# EasyEDA Pro project szu-etep-stc89c52rc-2024.epro

# Schematic Schematic1
Create Date: 2024-04-16; Page Name: P1; Project Name: classwork2; Schematic Name: Schematic1; Update Date: 2024-04-16; Company: 嘉立创EDA; Page Size: A4; Version: V1.0
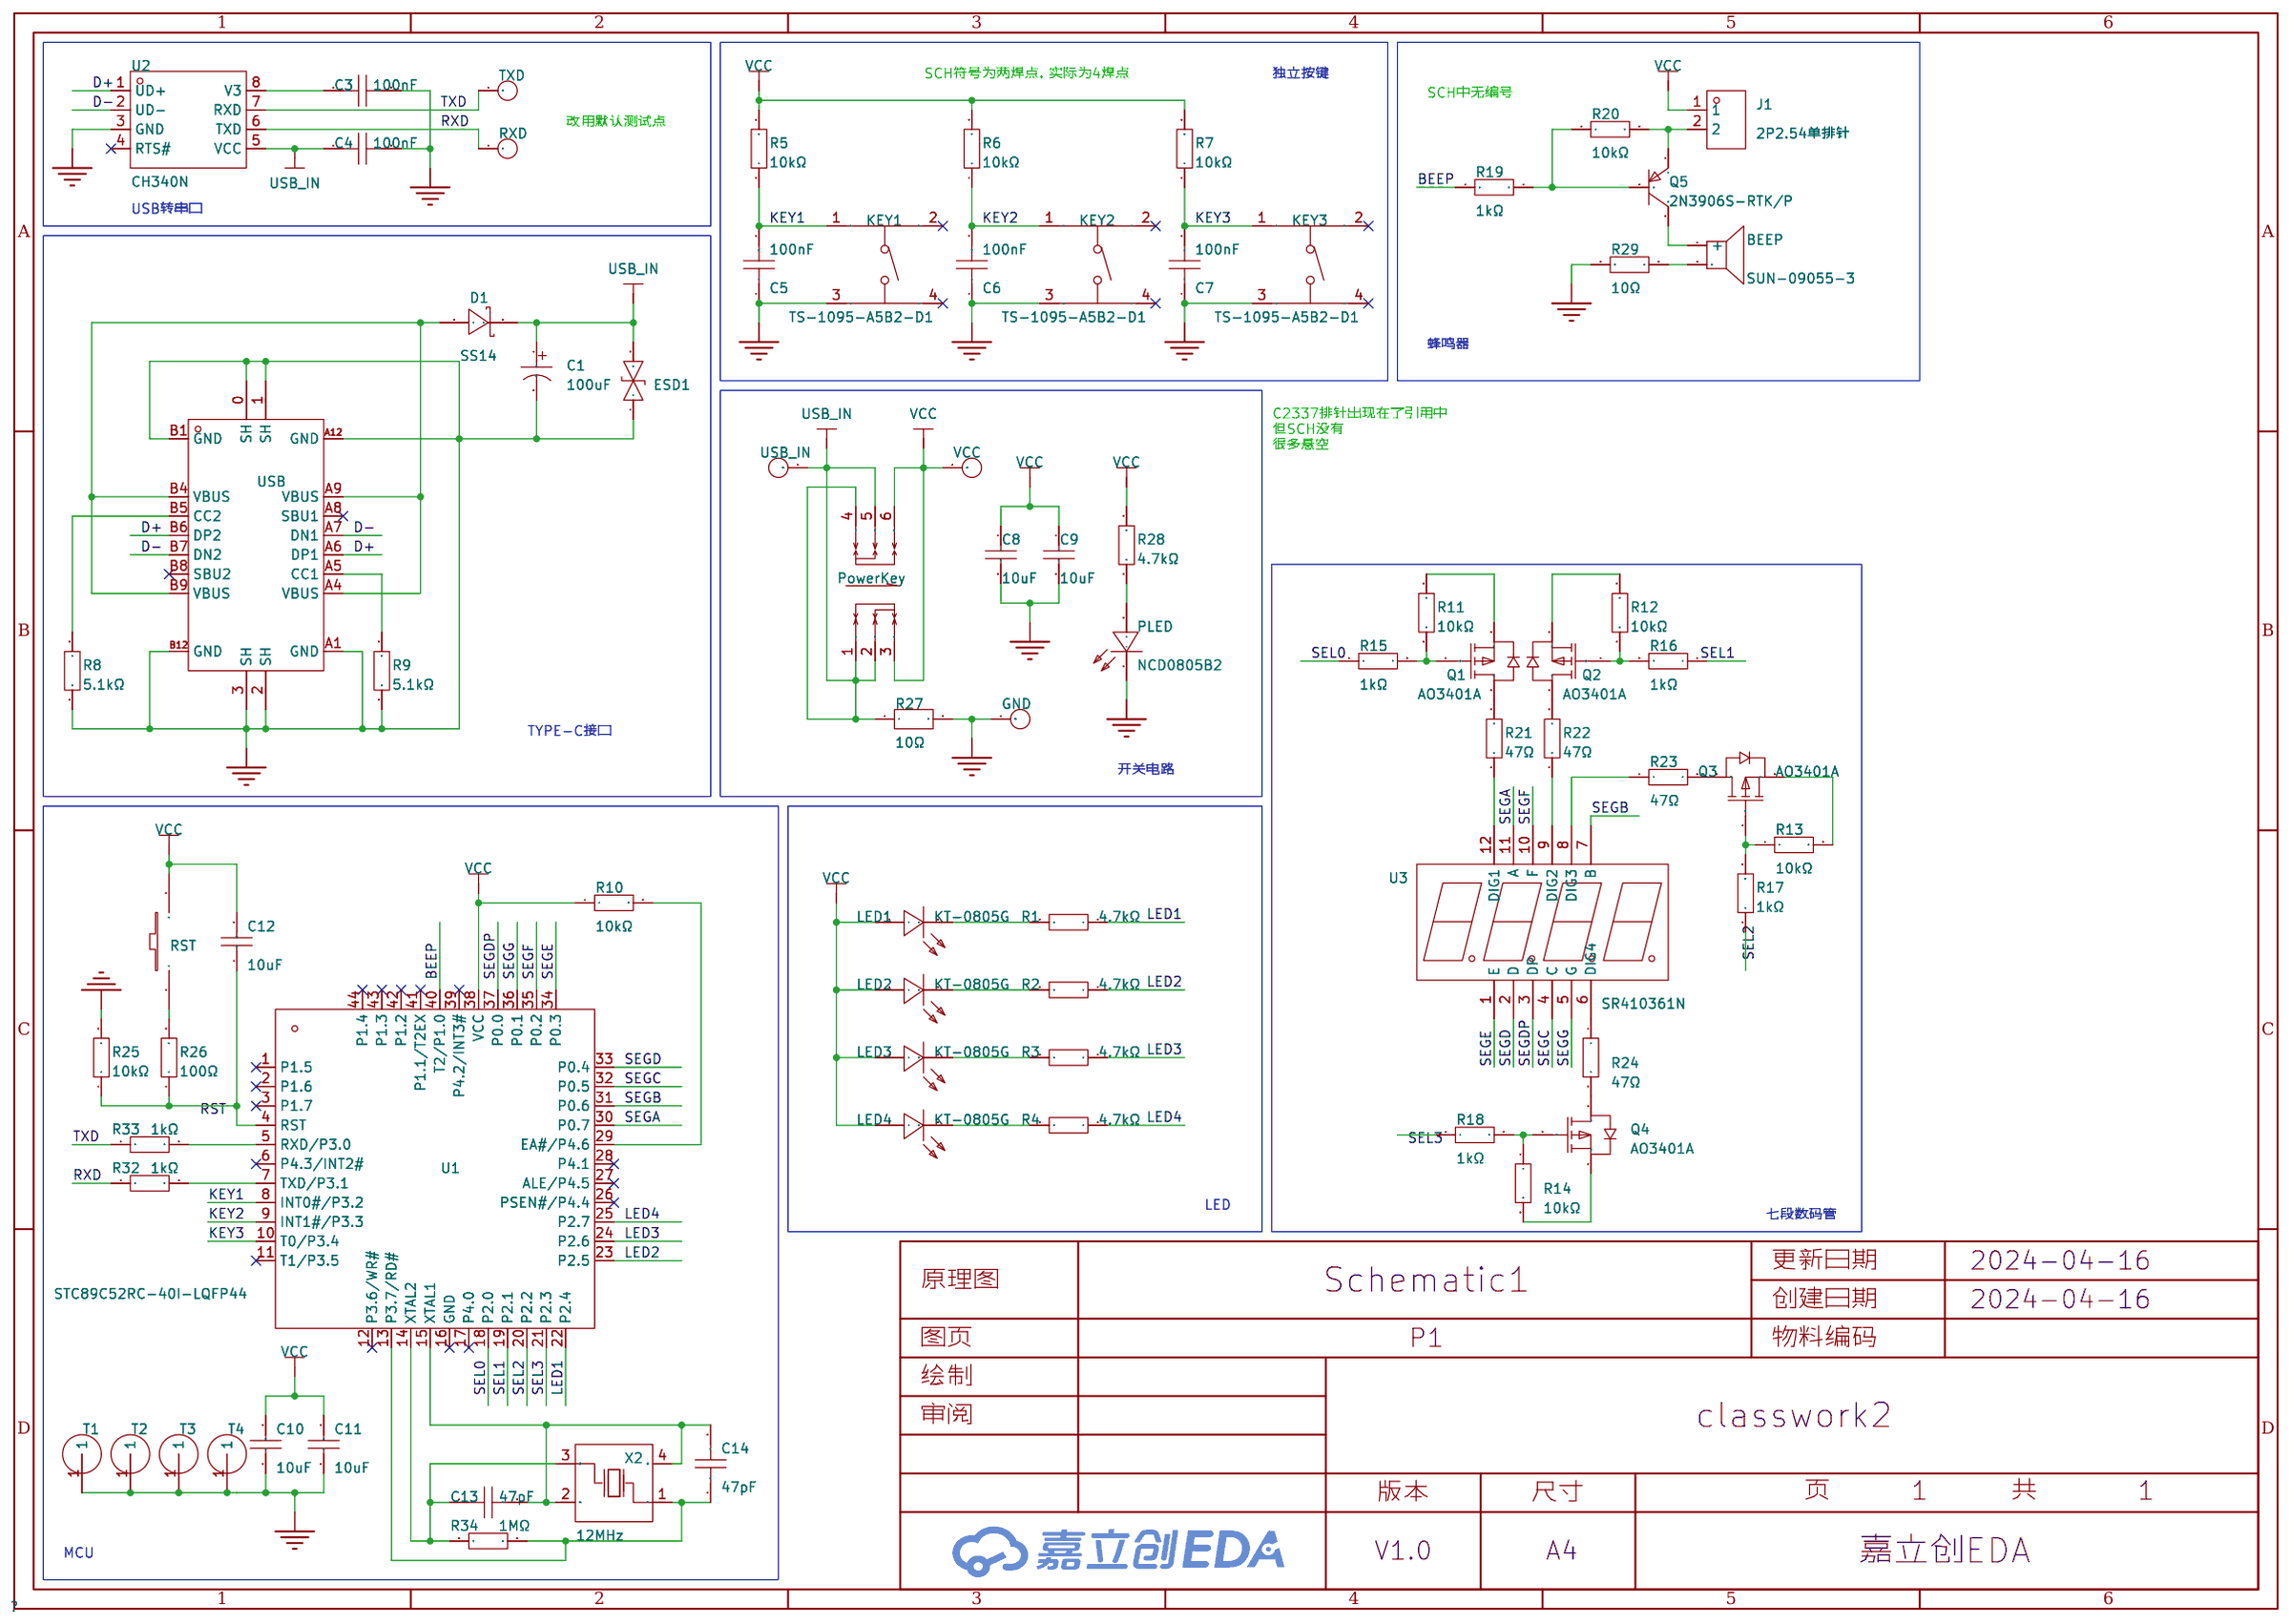
[diagram p0: schematic sheet]

## Parts
BEEP  SUN-09055-3  [BUZ-TH_BD9.0-P5.00-D0.6-FD]
C1  100uF  [CAP-TH_BD5.0-P2.00-D0.8-FD]
C3  100nF  [C0603]
C4  100nF  [C0603]
C5  100nF  [C0603]
C6  100nF  [C0603]
C7  100nF  [C0603]
C8  10uF  [C0603]
C9  10uF  [C0603]
C10  10uF  [C0603]
C11  10uF  [C0603]
C12  10uF  [C0603]
C13  47pF  [C0603]
C14  47pF  [C0603]
D1  SS14  [SMA_L4.3-W2.6-LS5.2-RD]
ESD1  0603ESDA-05N  [D0603-BI]
GND  -  [测试点0.9mm]
J1  2P2.54单排针  [HDR-TH_2P-P2.54-V-M]
KEY1  TS-1095-A5B2-D1  [SW-TH_4P-L6.0-W6.0-P4.50-LS6.5]
KEY2  TS-1095-A5B2-D1  [SW-TH_4P-L6.0-W6.0-P4.50-LS6.5]
KEY3  TS-1095-A5B2-D1  [SW-TH_4P-L6.0-W6.0-P4.50-LS6.5]
LED1  KT-0805G  [LED0805-R-RD]
LED2  KT-0805G  [LED0805-R-RD]
LED3  KT-0805G  [LED0805-R-RD]
LED4  KT-0805G  [LED0805-R-RD]
PLED  NCD0805B2  [LED0805-R-RD]
PowerKey  XKB8080-Z  [SW-TH_6P-L8.0-W8.0-P2.50]
Q1  AO3401A  [SOT-23_L2.9-W1.3-P1.90-LS2.4-BR]
Q2  AO3401A  [SOT-23_L2.9-W1.3-P1.90-LS2.4-BR]
Q3  AO3401A  [SOT-23_L2.9-W1.3-P1.90-LS2.4-BR]
Q4  AO3401A  [SOT-23_L2.9-W1.3-P1.90-LS2.4-BR]
Q5  2N3906S-RTK/P  [SOT-23-3_L2.9-W1.6-P1.90-LS2.8-TR-CW]
R1  4.7kΩ  [R0603]
R2  4.7kΩ  [R0603]
R3  4.7kΩ  [R0603]
R4  4.7kΩ  [R0603]
R5  10kΩ  [R0402]
R6  10kΩ  [R0402]
R7  10kΩ  [R0402]
R8  5.1kΩ  [R0603]
R9  5.1kΩ  [R0603]
R10  10kΩ  [R0402]
R11  10kΩ  [R0603]
R12  10kΩ  [R0603]
R13  10kΩ  [R0603]
R14  10kΩ  [R0603]
R15  1kΩ  [R0603]
R16  1kΩ  [R0603]
R17  1kΩ  [R0603]
R18  1kΩ  [R0603]
R19  1kΩ  [R0603]
R20  10kΩ  [R0603]
R21  47Ω  [R0603]
R22  47Ω  [R0603]
R23  47Ω  [R0603]
R24  47Ω  [R0603]
R25  10kΩ  [R0402]
R26  100Ω  [R0603]
R27  10Ω  [R1206]
R28  4.7kΩ  [R0603]
R29  10Ω  [R0603]
R32  1kΩ  [R0603]
R33  1kΩ  [R0603]
R34  1MΩ  [R0603]
RST  轻触开关,3*6*2.5塑头白色,260G,行程0.25mm,贴片 (SMT业务专用)  [SW-SMD_L6.1-W3.6-LS8.0]
RXD  -  [测试点0.9mm]
T1  -  [M3定位孔]
T2  -  [M3定位孔]
T3  -  [M3定位孔]
T4  -  [M3定位孔]
TXD  -  [测试点0.9mm]
U1  STC89C52RC-40I-LQFP44  [LQFP-44_L10.0-W10.0-P0.80-LS12.0-BL]
U2  CH340N  [SOP-8_L5.0-W4.0-P1.27-LS6.0-BL]
U3  SR410361N  [LED-SEG-TH_12P-L30.0-W14.0-P2.54-S10.26-BL]
USB  TYPE-C-31-M-12  [USB-C_SMD-TYPE-C-31-M-12]
USB_IN  -  [测试点0.9mm]
VCC  -  [测试点0.9mm]
X2  12MHz  [OSC-SMD_4P-L3.2-W2.5-BL]

## Library data of the parts
BEEP = SUN-09055-3: 频率2800+300Hz,1.5-5V电压驱动; LCSC Part Name: 有源9*5.5  3V; Supplier Part: C47620; Supplier Footprint: 插件; JLCPCB Part Class: Extended Part; Supplier: LCSC
C1 = KS107M016D07RR0VH2FP0: 容值:100uF;精度:±20%;额定电压:16V;纹波电流:-;等效串联电阻:-;; LCSC Part Name: 100uF ±20% 16V; Supplier Part: C43803; Manufacturer: CX(承兴); Supplier Footprint: 插件,D5xL7mm; JLCPCB Part Class: Extended Part; Datasheet: https://atta.szlcsc.com/upload/public/pdf/source/20230817/0DB19D47181DB7F2222DAA6444591EF5.pdf; Supplier: LCSC; Tolerance: ±20%; Rated Voltage: 16V; Lead Spacing: 2mm; φD: 5mm; L: 7mm; Lifetime @ Temp: 1000hrs@105℃; Operating Temperature: -40℃~+105℃
C3-C7 = CC0603KRX7R9BB104: 容值:100nF;精度:±10%;额定电压:50V;材质(温度系数):X7R;; LCSC Part Name: 100nF ±10% 50V; Supplier Part: C14663; Manufacturer: YAGEO(国巨); Supplier Footprint: 0603; JLCPCB Part Class: Basic Part; Datasheet: https://atta.szlcsc.com/upload/public/pdf/source/20180910/C282072_33301C7F631E79921B82A8DAC6BCC5B3.pdf; Supplier: LCSC; Tolerance: ±10%; Voltage Rated: 50V; Temperature Coefficient: X7R
C8-C12 = 0603X106K160NT: 容值:10uF;精度:±10%;额定电压:16V;材质(温度系数):X5R;; LCSC Part Name: 10uF ±10% 16V; Supplier Part: C70225; Manufacturer: FH(风华); Supplier Footprint: 0603; JLCPCB Part Class: Extended Part; Datasheet: https://atta.szlcsc.com/upload/public/pdf/source/20230412/C337795AFAE950D23C36836E9FAB4272.pdf; Supplier: LCSC; Tolerance: ±10%; Voltage Rated: 16V; Temperature Coefficient: X5R
C13 C14 = CL10C470JC8NNNC: 容值:47pF;精度:±5%;额定电压:100V;材质(温度系数):C0G;; LCSC Part Name: 47pF ±5% 100V; Supplier Part: C318679; Manufacturer: SAMSUNG(三星); Supplier Footprint: 0603; JLCPCB Part Class: Extended Part; Datasheet: https://atta.szlcsc.com/upload/public/pdf/source/20190515/C318679_5C71FE76D63C3D08CC00B58055CEDD95.pdf; Supplier: LCSC; Tolerance: ±5%; Voltage Rated: 100V; Temperature Coefficient: C0G
D1 = SS14_C84343: 正向压降(Vf):550mV@1A;直流反向耐压(Vr):40V;平均整流电流(Io):1A;; LCSC Part Name: 电压:40V 电流:1A; Supplier Part: C84343; Manufacturer: 星海; Supplier Footprint: SMA(DO-214AC); JLCPCB Part Class: Extended Part; Datasheet: https://atta.szlcsc.com/upload/public/pdf/source/20161024/1477288745231.pdf; Supplier: LCSC; Forward Voltage (Vf@If): 550mV@1A; Reverse Voltage (Vr): 40V; Average Rectified Current (Io): 1A
ESD1 = 0603ESDA-05N: 极性:双向;反向截止电压(Vrwm):5V;最大钳位电压:50V;; LCSC Part Name: 双向ESD; Supplier Part: C316054; Manufacturer: BORN(伯恩半导体); Supplier Footprint: 0603; JLCPCB Part Class: Extended Part; Datasheet: https://atta.szlcsc.com/upload/public/pdf/source/20200528/C316054_1CC523E9CE69E41C8DD5A05C832CCD1A.pdf; Supplier: LCSC; polarity: 双向; Reverse Stand-Off Voltage (Vrwm): 5V; Maximum Clamping Voltage: 50V; Type: ESD
GND RXD TXD USB_IN VCC = 测试点0.9mm: _: 3
J1 = 2P2.54单排针: Supplier Part: C9900015265; Supplier Footprint: HDR1X2; JLCPCB Part Class: Extended Part; Supplier: LCSC
KEY1-KEY3 = TS-1095-A5B2-D1: 电路结构:单刀单掷;按钮形状:圆形按钮;作用力:180gf;安装方式:直插;开关长度:6mm;开关宽度:6mm;开关高度:6mm;带支架:不带;机械寿命:-;; LCSC Part Name: 6*6*6mm 直插 轻触开关; Supplier Part: C782808; Manufacturer: Yuandi(元迪); Supplier Footprint: 插件; JLCPCB Part Class: Extended Part; Datasheet: https://atta.szlcsc.com/upload/public/pdf/source/20200908/C782804_D14F61DCCBE05C7EE913124CF28857B3.pdf; Supplier: LCSC; Circuit: 单刀单掷; Actuator Style: 圆形按钮; Operating Force: 180gf; Mounting Style: 直插; Switch Length: 6mm; Switch Width: 6mm; Switch Height: 6mm; Strike Gundam: 不带; Actuator/Cap Color: 黑色; Pin Style: PC引脚
LED1-LED4 = KT-0805G: 灯头类型:-;发光颜色:翠绿色;正向电压(VF):-;功率:-;正向电流:-;主波长:-;二极管配置:-;透镜颜色:-;色温:-;发光强度:-;发光角度:-;载带方式:-;工作温度:-;; LCSC Part Name: 0805 翠绿 高亮; Supplier Part: C2297; Manufacturer: KENTO; Supplier Footprint: 0805; JLCPCB Part Class: Basic Part; Datasheet: https://atta.szlcsc.com/upload/public/pdf/source/20170209/1486607340485.pdf; Supplier: LCSC; Emitted Color: 翠绿色
PLED = NCD0805B2: 发光颜色:蓝色;正向电压(VF):2.5V~3.6V;功率:72mW;正向电流:2mA;主波长:468nm~478nm;透镜颜色:无色透明透镜;发光强度:20mcd~55mcd;发光角度:130°;工作温度:-30℃~+85℃;; Supplier Part: C84259; Manufacturer: 国星光电; Supplier Footprint: 0805; JLCPCB Part Class: Extended Part; Datasheet: https://atta.szlcsc.com/upload/public/pdf/source/20200820/C84259_E5AC6865415989C4C2C2831134BA3A23.pdf; Supplier: LCSC; Emitted Color: 蓝色; Forward Voltage (VF): 2.5V~3.6V; Power Dissipation: 72mW; Forward Current: 2mA; Dominant Wavelength: 468nm~478nm; Lens Color: 无色透明透镜; Luminous Intensity: 20mcd~55mcd; Viewing Angle: 130°; Operating Temperature: -30℃~+85℃
PowerKey = XKB8080-Z: 自锁/无锁:自锁;安装方式:直插;触点电流:100mA;额定电压 (AC):250V;额定电压 (DC):30V;带灯:不带;作用力:160gf;机械寿命:10万次;; LCSC Part Name: 8*8 蓝白黑 自锁开关; Supplier Part: C318860; Manufacturer: XKB Connectivity(中国星坤); Supplier Footprint: 插件; JLCPCB Part Class: Extended Part; Datasheet: https://atta.szlcsc.com/upload/public/pdf/source/20200227/C318861_0CCDF4510CAD1098054D1FAD25282ED5.pdf; Supplier: LCSC; Self Lock / No Lock: 自锁; Actuator Style: 矩形按钮; Mounting Style: 直插; Contact Current: 100mA; Voltage Rating (AC): 250V; Voltage Rating (DC): 30V; Insulation Resistance: 100MΩ; Actuator/Cap Color: 蓝色; With Lamp: 不带; Pin Style: PC引脚; Operating Force: 160gf; Operating Temperature: -15℃~+55℃; Mechanical Life: 10万次
Q1-Q4 = AO3401A_C15127: 类型:P沟道;漏源电压(Vdss):30V;连续漏极电流(Id):4A;功率(Pd):1.4W;导通电阻(RDS(on)@Vgs,Id):44mΩ@10V,4.3A;阈值电压(Vgs(th)@Id):1.3V@250uA;; LCSC Part Name: P沟道 耐压:30V 电流:4A; Supplier Part: C15127; Manufacturer: AOS; Supplier Footprint: SOT-23; JLCPCB Part Class: Basic Part; Datasheet: https://atta.szlcsc.com/upload/public/pdf/source/20160507/1462613609053.pdf; Supplier: LCSC; Type: P沟道; Drain Source Voltage (Vdss): 30V; Continuous Drain Current (Id): 4A; Power Dissipation (Pd): 1.4W; Drain Source On Resistance (RDS(on)@Vgs,Id): 44mΩ@10V,4.3A; Gate Threshold Voltage (Vgs(th)@Id): 1.3V@250uA; Total Gate Charge (Qg@Vgs): 12.2nC@4.5V; Input Capacitance (Ciss@Vds): 1.2nF@15V; Operating Temperature: -55℃~+150℃@(Tj)
Q5 = 2N3906S-RTK/P_C147294: 晶体管类型:PNP;集电极电流(Ic):200mA;集射极击穿电压(Vceo):40V;功率(Pd):350mW;直流电流增益(hFE@Ic,Vce):100@10mA,1V;; LCSC Part Name: PNP 电流:200mA 耐压:40V; Supplier Part: C147294; Manufacturer: KEC; Supplier Footprint: SOT-23; JLCPCB Part Class: Extended Part; Datasheet: https://atta.szlcsc.com/upload/public/pdf/source/20180105/C147294_15151573468251234610.pdf; Supplier: LCSC; Transistor Type: PNP; Collector Current (Ic): 200mA; Collector-Emitter Breakdown Voltage (Vceo): 40V; Power Dissipation (Pd): 350mW; DC Current Gain (hFE@Ic,Vce): 100@10mA,1V; Transition Frequency (fT): 250MHz; Collector-Emitter Saturation Voltage (VCE(sat)@Ic,Ib): 400mV@50mA,5mA
R1-R4 R28 = 0603WAF4701T5E: 电阻类型:厚膜电阻;阻值:4.7kΩ;精度:±1%;功率:100mW;最大工作电压:75V;温度系数:±100ppm/℃;; LCSC Part Name: 4.7kΩ ±1% 100mW 厚膜电阻; Supplier Part: C23162; Manufacturer: UNI-ROYAL(厚声); Supplier Footprint: 0603; JLCPCB Part Class: Basic Part; Datasheet: https://atta.szlcsc.com/upload/public/pdf/source/20200306/C422600_1E6D84923E4A46A82E41ADD87F860B5C.pdf; Supplier: LCSC; Type: 厚膜电阻; Tolerance: ±1%; Power(Watts): 100mW; Overload Voltage (Max): 75V; Temperature Coefficient: ±100ppm/℃; Operating Temperature Range: -55℃~+155℃
R5-R7 R10 R25 = 0402WGF1002TCE: 电阻类型:厚膜电阻;阻值:10kΩ;精度:±1%;功率:62.5mW;最大工作电压:50V;温度系数:±100ppm/℃;; LCSC Part Name: 10kΩ ±1% 62.5mW 厚膜电阻; Supplier Part: C25744; Manufacturer: UNI-ROYAL(厚声); Supplier Footprint: 0402; JLCPCB Part Class: Basic Part; Datasheet: https://atta.szlcsc.com/upload/public/pdf/source/20200306/C422600_1E6D84923E4A46A82E41ADD87F860B5C.pdf; Supplier: LCSC; Type: 厚膜电阻; Tolerance: ±1%; Power(Watts): 62.5mW; Overload Voltage (Max): 50V; Temperature Coefficient: ±100ppm/℃; Operating Temperature Range: -55℃~+155℃
R8 R9 = 0603WAF5101T5E: 电阻类型:厚膜电阻;阻值:5.1kΩ;精度:±1%;功率:100mW;最大工作电压:75V;温度系数:±100ppm/℃;; LCSC Part Name: 5.1kΩ ±1% 100mW 厚膜电阻; Supplier Part: C23186; Manufacturer: UNI-ROYAL(厚声); Supplier Footprint: 0603; JLCPCB Part Class: Basic Part; Datasheet: https://atta.szlcsc.com/upload/public/pdf/source/20200306/C422600_1E6D84923E4A46A82E41ADD87F860B5C.pdf; Supplier: LCSC; Type: 厚膜电阻; Tolerance: ±1%; Power(Watts): 100mW; Overload Voltage (Max): 75V; Temperature Coefficient: ±100ppm/℃; Operating Temperature Range: -55℃~+155℃
R11-R14 R20 = 0603WAF1002T5E: 电阻类型:厚膜电阻;阻值:10kΩ;精度:±1%;功率:100mW;最大工作电压:75V;温度系数:±100ppm/℃;; LCSC Part Name: 厚膜电阻 10kΩ ±1% 100mW; Supplier Part: C25804; Manufacturer: UNI-ROYAL(厚声); Supplier Footprint: 0603; JLCPCB Part Class: Basic Part; Datasheet: https://atta.szlcsc.com/upload/public/pdf/source/20200306/C422600_1E6D84923E4A46A82E41ADD87F860B5C.pdf; Supplier: LCSC; Type: 厚膜电阻; Tolerance: ±1%; Power(Watts): 100mW; Overload Voltage (Max): 75V; Temperature Coefficient: ±100ppm/℃; Operating Temperature Range: -55℃~+155℃
R15-R19 R32 R33 = 0603WAF1001T5E: 电阻类型:厚膜电阻;阻值:1kΩ;精度:±1%;功率:100mW;最大工作电压:75V;温度系数:±100ppm/℃;; LCSC Part Name: 1kΩ ±1% 100mW 厚膜电阻; Supplier Part: C21190; Manufacturer: UNI-ROYAL(厚声); Supplier Footprint: 0603; JLCPCB Part Class: Basic Part; Datasheet: https://atta.szlcsc.com/upload/public/pdf/source/20200306/C422600_1E6D84923E4A46A82E41ADD87F860B5C.pdf; Supplier: LCSC; Type: 厚膜电阻; Tolerance: ±1%; Power(Watts): 100mW; Overload Voltage (Max): 75V; Temperature Coefficient: ±100ppm/℃; Operating Temperature Range: -55℃~+155℃
R21-R24 = 0603WAF470JT5E: 电阻类型:厚膜电阻;阻值:47Ω;精度:±1%;功率:100mW;最大工作电压:75V;温度系数:±100ppm/℃;; LCSC Part Name: 47Ω ±1% 100mW 厚膜电阻; Supplier Part: C23182; Manufacturer: UNI-ROYAL(厚声); Supplier Footprint: 0603; JLCPCB Part Class: Basic Part; Datasheet: https://atta.szlcsc.com/upload/public/pdf/source/20200306/C422600_1E6D84923E4A46A82E41ADD87F860B5C.pdf; Supplier: LCSC; Type: 厚膜电阻; Tolerance: ±1%; Power(Watts): 100mW; Overload Voltage (Max): 75V; Temperature Coefficient: ±100ppm/℃; Operating Temperature Range: -55℃~+155℃
R26 = 0603WAF1000T5E: 电阻类型:厚膜电阻;阻值:100Ω;精度:±1%;功率:100mW;最大工作电压:75V;温度系数:±200ppm/℃;; LCSC Part Name: 100Ω ±1% 100mW 厚膜电阻; Supplier Part: C22775; Manufacturer: UNI-ROYAL(厚声); Supplier Footprint: 0603; JLCPCB Part Class: Basic Part; Datasheet: https://atta.szlcsc.com/upload/public/pdf/source/20200306/C422600_1E6D84923E4A46A82E41ADD87F860B5C.pdf; Supplier: LCSC; Type: 厚膜电阻; Tolerance: ±1%; Power(Watts): 100mW; Overload Voltage (Max): 75V; Temperature Coefficient: ±200ppm/℃; Operating Temperature Range: -55℃~+155℃
R27 = AS0606K0100T5E: 电阻类型:厚膜电阻;阻值:10Ω;精度:±10%;功率:600mW;最大工作电压:200V;温度系数:±400ppm/℃;; LCSC Part Name: 10Ω ±10% 600mW 厚膜电阻; Supplier Part: C560638; Manufacturer: UNI-ROYAL(厚声); Supplier Footprint: 1206; JLCPCB Part Class: Extended Part; Datasheet: https://atta.szlcsc.com/upload/public/pdf/source/20200723/C560412_34ABBCC623B52ADD707B94178459E29E.pdf; Supplier: LCSC; Type: 厚膜电阻; Tolerance: ±10%; Power(Watts): 600mW; Overload Voltage (Max): 200V; Temperature Coefficient: ±400ppm/℃; Operating Temperature Range: -55℃~+155℃
R29 = 0603WAF100JT5E: 电阻类型:厚膜电阻;阻值:10Ω;精度:±1%;功率:100mW;最大工作电压:75V;温度系数:±400ppm/℃;; LCSC Part Name: 10Ω ±1% 100mW 厚膜电阻; Supplier Part: C22859; Manufacturer: UNI-ROYAL(厚声); Supplier Footprint: 0603; JLCPCB Part Class: Basic Part; Datasheet: https://atta.szlcsc.com/upload/public/pdf/source/20200306/C422600_1E6D84923E4A46A82E41ADD87F860B5C.pdf; Supplier: LCSC; Type: 厚膜电阻; Tolerance: ±1%; Power(Watts): 100mW; Overload Voltage (Max): 75V; Temperature Coefficient: ±400ppm/℃; Operating Temperature Range: -55℃~+155℃
R34 = 0603WAF1004T5E: 电阻类型:厚膜电阻;阻值:1MΩ;精度:±1%;功率:100mW;最大工作电压:75V;温度系数:±100ppm/℃;; LCSC Part Name: 1MΩ ±1% 100mW 厚膜电阻; Supplier Part: C22935; Manufacturer: UNI-ROYAL(厚声); Supplier Footprint: 0603; JLCPCB Part Class: Basic Part; Datasheet: https://atta.szlcsc.com/upload/public/pdf/source/20200306/C422600_1E6D84923E4A46A82E41ADD87F860B5C.pdf; Supplier: LCSC; Type: 厚膜电阻; Tolerance: ±1%; Power(Watts): 100mW; Overload Voltage (Max): 75V; Temperature Coefficient: ±100ppm/℃; Operating Temperature Range: -55℃~+155℃
RST = 轻触开关,3*6*2.5塑头白色,260G,行程0.25mm,贴片 (SMT业务专用): LCSC Part Name: 轻触开关,3*6*2.5塑头白色,260G,行程0.25mm,贴片   (SMT业务专用); Supplier Part: C71857; Supplier Footprint: SMD; JLCPCB Part Class: Extended Part; Datasheet: https://atta.szlcsc.com/upload/public/pdf/source/20160427/1461725218304.pdf; Supplier: LCSC
T1-T4 = M3定位孔
U1 = STC89C52RC-40I-LQFP44: CPU内核:51系列;程序存储容量:8KB;RAM总容量:512Byte;GPIO端口数量:39;工作电压范围:3.3V~5.5V;CPU最大主频:-;程序存储器类型:FLASH;; Supplier Part: C8707; Manufacturer: STC(宏晶); Supplier Footprint: LQFP-44(10x10); JLCPCB Part Class: Extended Part; Datasheet: https://atta.szlcsc.com/upload/public/pdf/source/20131218/1457706663573.pdf; Supplier: LCSC; CPU Core: 51系列; Program Storage Size: 8KB; RAM Size: 512Byte; GPIO Ports Number: 39; Operating Voltage Range: 3.3V~5.5V; Program Memory Type: FLASH; Operating Temperature Range: -40℃~+85℃; 16Bit Timer: 3; UART/USART: 1; Peripheral/Function: 看门狗; Watchdog: 有
U2 = CH340N_C506813: 应用功能:-;接口协议:-;; LCSC Part Name: USB转串口芯片 CH340; Supplier Part: C506813; Manufacturer: WCH(南京沁恒); Supplier Footprint: SOP-8; JLCPCB Part Class: Extended Part; Datasheet: https://atta.szlcsc.com/upload/public/pdf/source/20200819/C84681_ADBED554CE321879DBD6B1D06488689C.pdf; Supplier: LCSC
U3 = SR410361N: 数码管位数:4位;发光颜色:红色;LED极性:共阳极;数字/字母大小(英寸):0.36;; LCSC Part Name: 4位0.36英寸红色数码管 共阳极; Supplier Part: C132660; Manufacturer: ARKLED(方舟); Supplier Footprint: 插件; JLCPCB Part Class: Extended Part; Datasheet: https://atta.szlcsc.com/upload/public/pdf/source/20171014/C132660_15079754140001038126.pdf; Supplier: LCSC; Number of Characters: 4位; Luminous Color: 红色; LED Polarity: 共阳极; Digit/Alpha Size(inch): 0.36
USB = TYPE-C-31-M-12: 连接器类型:Type-C;标准:-;公母:母;端口数量:1;触点数量:16P;安装方式:-;额定电流 - 电源:5A;触头材质:-;触头镀层:-;工作温度范围:-;焊接温度(最大值):-;; LCSC Part Name: Type-C 母; Supplier Part: C165948; Manufacturer: 韩国韩荣; Supplier Footprint: SMD; JLCPCB Part Class: Extended Part; Datasheet: https://atta.szlcsc.com/upload/public/pdf/source/20220525/466408E853115E789EDB0DDC29077C05.pdf; Supplier: LCSC; Connector Type: Type-C; Gender: 母; Number of Ports: 1; Number of Contacts: 16P; Current Rating - Power (Max): 5A
X2 = X322512MSB4SI: 晶振类型:贴片晶振;频率:12MHz;常温频差:±10ppm;外接负载电容:20pF;频率稳定度(全温):±20ppm;; LCSC Part Name: 12MHz ±10ppm 20pF; Supplier Part: C9002; Manufacturer: YXC(扬兴晶振); Supplier Footprint: SMD3225-4P; JLCPCB Part Class: Basic Part; Datasheet: https://atta.szlcsc.com/upload/public/pdf/source/20240329/19D5F850207469550BEB00D7DFEDBC7A.pdf; Supplier: LCSC; Crystal Type: 贴片晶振; Normal temperature Frequency Tolerance: ±10ppm; External load capacitor: 20pF; Frequency Stability(Full temperature range): ±20ppm; Operating Temperature: -40℃~+85℃

## Nets
GND: C1.2 C3.2 C4.2 C5.1 C6.1 C7.1 C8.2 C9.2 C10.2 C11.2 ESD1.1 GND.1(Pin1) KEY1.3 KEY2.3 KEY3.3 PLED.2(-) R8.1 R9.1 R25.2 R27.2 R29.2 T1.1 T2.1 T3.1 T4.1 U2.3(GND) USB.0(SH) USB.1(SH) USB.2(SH) USB.3(SH) USB.A1(GND) USB.A12(GND) USB.B1(GND) USB.B12(GND)
VCC: C8.1 C9.1 C10.1 C11.1 C12.2 J1.1 LED1.1(A) LED2.1(A) LED3.1(A) LED4.1(A) PowerKey.3 PowerKey.6 R5.2 R6.2 R7.2 R10.1 R28.2 RST.2 U1.38(VCC) VCC.1(Pin1)
BEEP: R19.1 U1.40(T2/P1.0)
D+: U2.1(UD+) USB.A6(DP1) USB.B6(DP2)
D-: U2.2(UD-) USB.A7(DN1) USB.B7(DN2)
KEY1: C5.2 KEY1.1 R5.1 U1.8(INT0#/P3.2)
KEY2: C6.2 KEY2.1 R6.1 U1.9(INT1#/P3.3)
KEY3: C7.2 KEY3.1 R7.1 U1.10(T0/P3.4)
LED1: R1.1 U1.22(P2.4)
LED2: R2.1 U1.23(P2.5)
LED3: R3.1 U1.24(P2.6)
LED4: R4.1 U1.25(P2.7)
RST: C12.1 R25.1 R26.1 U1.4(RST)
RXD: R32.1 RXD.1(Pin1) U2.6(TXD)
SEGA: U1.30(P0.7) U3.11(A)
SEGB: U1.31(P0.6) U3.7(B)
SEGC: U1.32(P0.5) U3.4(C)
SEGD: U1.33(P0.4) U3.2(D)
SEGDP: U1.37(P0.0) U3.3(DP)
SEGE: U1.34(P0.3) U3.1(E)
SEGF: U1.35(P0.2) U3.10(F)
SEGG: U1.36(P0.1) U3.5(G)
SEL0: R15.1 U1.18(P2.0)
SEL1: R16.1 U1.19(P2.1)
SEL2: R17.1 U1.20(P2.2)
SEL3: R18.1 U1.21(P2.3)
TXD: R33.1 TXD.1(Pin1) U2.7(RXD)
USB_IN: C1.1 C4.1 D1.1(K) ESD1.2 PowerKey.1 PowerKey.2 PowerKey.4 PowerKey.5 R27.1 U2.5(VCC) USB_IN.1(Pin1)
$1N3771: R9.2 USB.A5(CC1)
$1N4055: C3.1 U2.8(V3)
$1N8289: PLED.1(+) R28.1
$1N8781: LED1.2(K) R1.2
$1N8784: LED2.2(K) R2.2
$1N8787: LED3.2(K) R3.2
$1N8790: LED4.2(K) R4.2
$1N10096: BEEP.2 R29.1
$1N10100: BEEP.1(+) Q5.3(C)
$1N10108: Q5.2(B) R19.2 R20.1
$1N10210: J1.2 Q5.1(E) R20.2
$1N11626: R33.2 U1.5(RXD/P3.0)
$1N11629: R32.2 U1.7(TXD/P3.1)
$1N11974: R26.2 RST.1
$1N12457: C14.1 R34.1 U1.13(P3.7/RD#) X2.1(OSC1)
$1N12469: C13.1 R34.2 U1.14(XTAL2) X2.3(OSC2)
$1N12478: C13.2 C14.2 U1.15(XTAL1) X2.2(GND) X2.4(GND)
$1N14587: R10.2 U1.29(EA#/P4.6)
$1N21020: R21.1 U3.12(DIG1)
$1N21183: Q2.1(G) R12.1 R16.2
$1N21186: Q2.3(D) R22.2
$1N21187: Q2.2(S) R12.2
$1N21192: R22.1 U3.9(DIG2)
$1N21353: Q3.1(G) R13.1 R17.2
$1N21356: Q3.3(D) R23.2
$1N21357: Q3.2(S) R13.2
$1N21513: Q1.1(G) R11.1 R15.2
$1N21516: Q1.3(D) R21.2
$1N21517: Q1.2(S) R11.2
$1N21530: R23.1 U3.8(DIG3)
$1N21889: Q4.1(G) R14.1 R18.2
$1N21892: Q4.3(D) R24.2
$1N21893: Q4.2(S) R14.2
$1N21896: R24.1 U3.6(DIG4)
$1N26570: R8.2 USB.B5(CC2)
$1N26577: D1.2(A) USB.A4(VBUS) USB.A9(VBUS) USB.B4(VBUS) USB.B9(VBUS)

Not connected (* = marked no-connect by the designer): KEY1 2* 4*; KEY2 2* 4*; KEY3 2* 4*; U1 1(P1.5)* 2(P1.6)* 3(P1.7)* 6(P4.3/INT2#)* 11(T1/P3.5)* 12(P3.6/WR#)* 16(GND)* 17(P4.0)* 26(PSEN#/P4.4)* 27(ALE/P4.5)* 28(P4.1)* 39(P4.2/INT3#)* 41(P1.1/T2EX)* 42(P1.2)* 43(P1.3)* 44(P1.4)*; U2 4(RTS#)*; USB A8(SBU1)* B8(SBU2)*

## Notes on the sheet
- SCH符号为两焊点，实际为4焊点
- 独立按键
- SCH中无编号
- 改用默认测试点
- USB转串口
- 蜂鸣器
- C2337排针出现在了引用中
  但SCH没有
  很多悬空
- TYPE-C接口
- 开关电路
- LED
- 七段数码管
- MCU

# Board PCB1
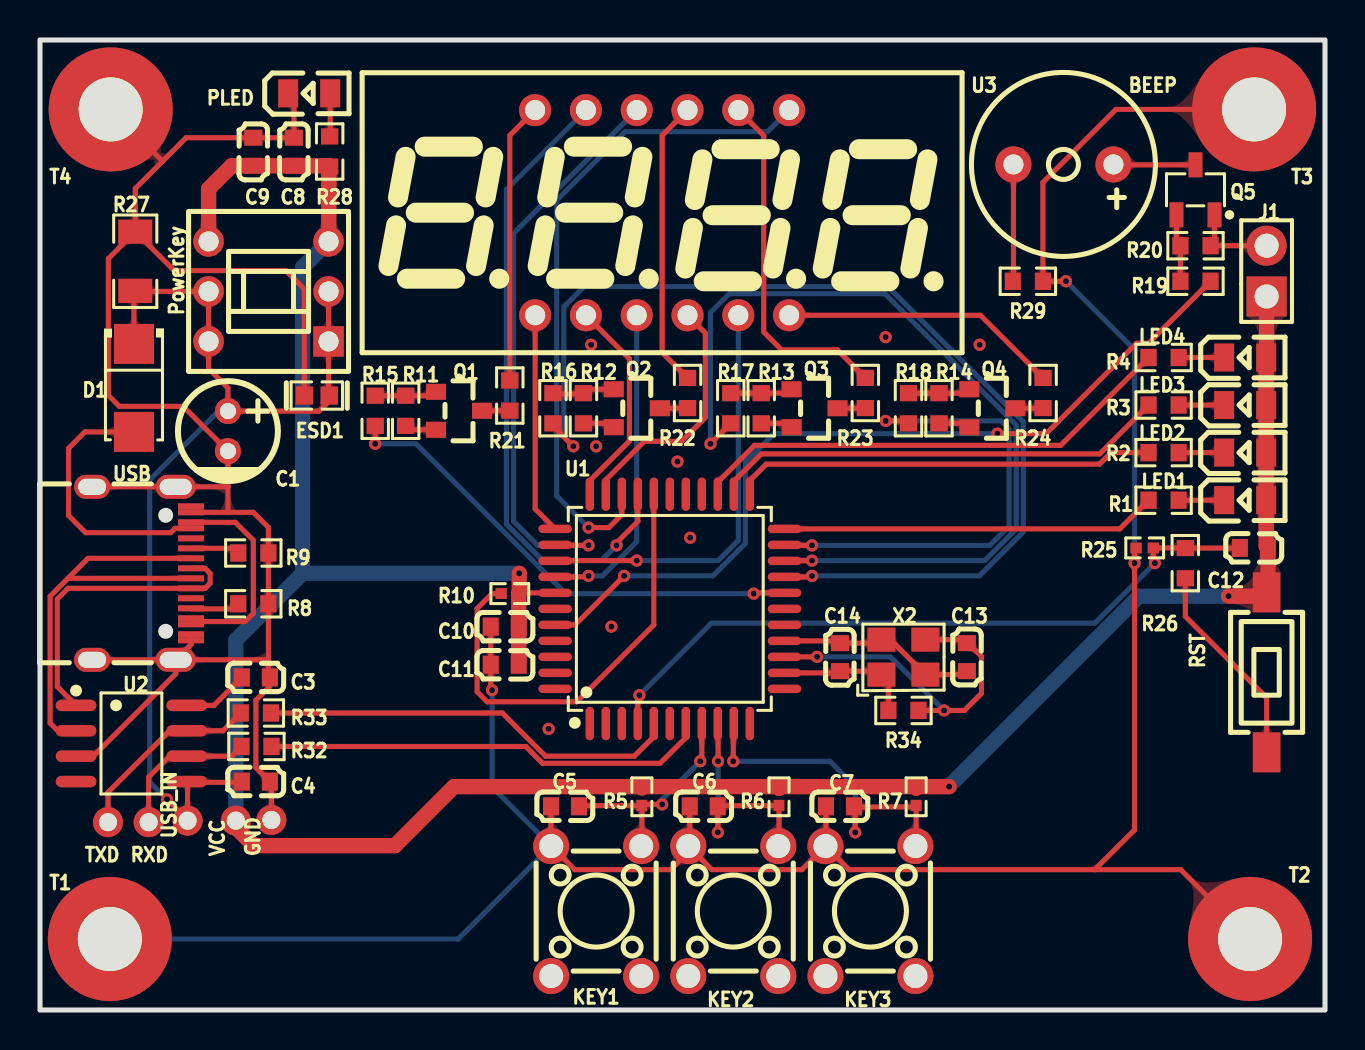
[diagram p1: board, top side]
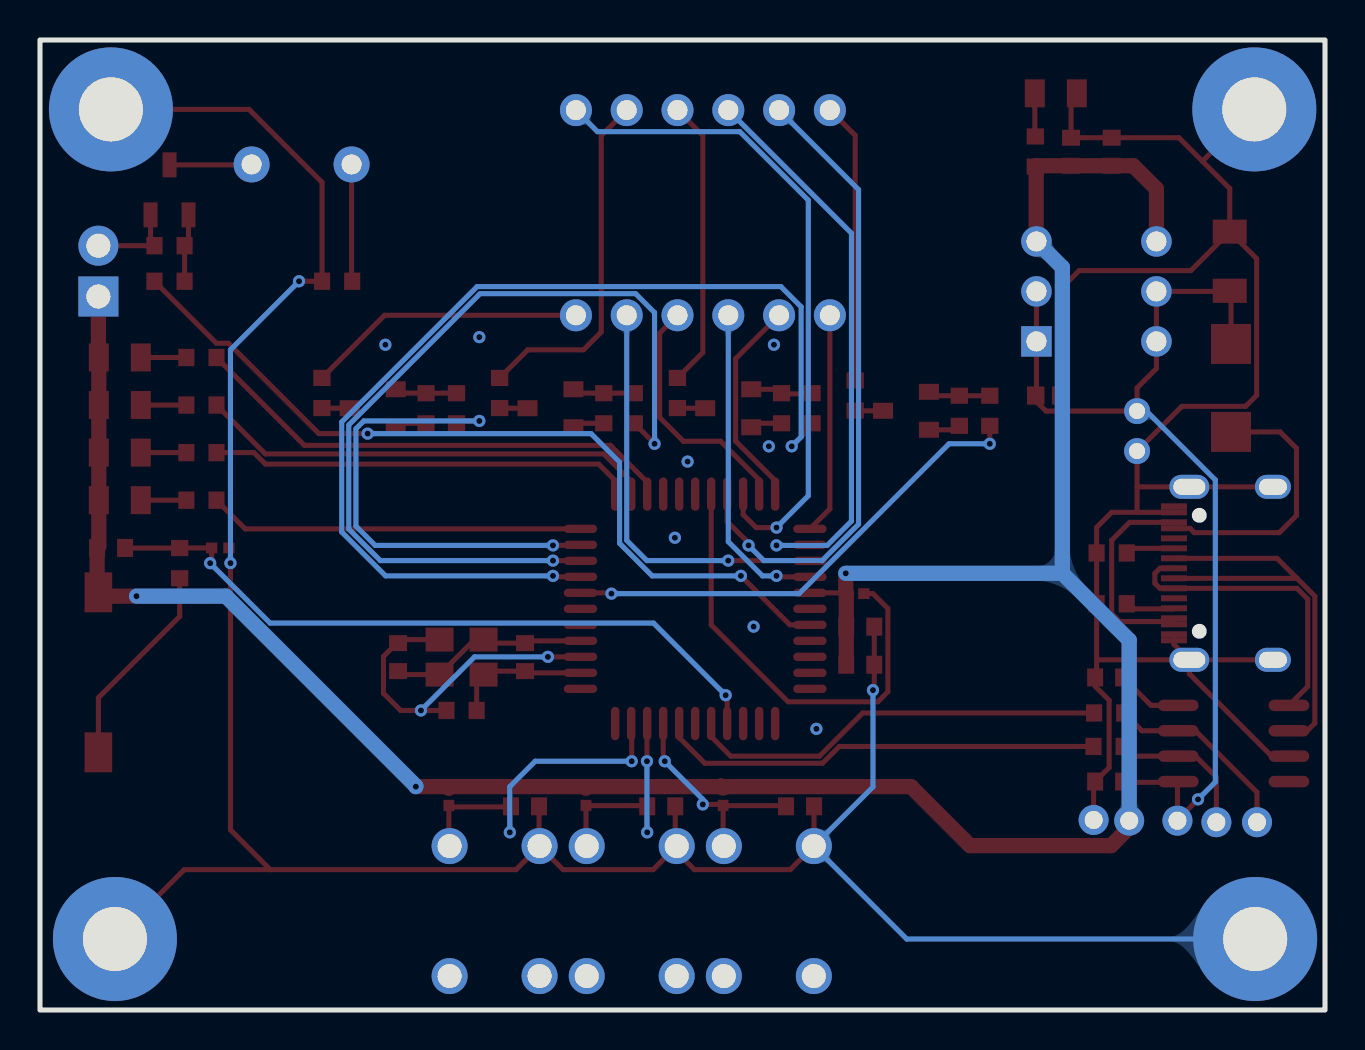
[diagram p2: board, bottom side, seen from below]

Outline 64.26 x 48.51 mm; copper layers: Top Layer, Bottom Layer. Coordinates in mm from the lower left corner of the outline.
Outline path: rectangle 0,48.51 64.26,0
Stack: Top Layer 0.035mm / Dielectric1 1.51mm FR4 er 4.5 / Bottom Layer 0.035mm

## Design rules (mm)
template: JLCPCB Capability(Two Layers Board)
spacing copperThickness1oz (default): track to track 0.102, other pairs 0.152 to 0.3
spacing copperThickness2oz: track to track 0.203, other pairs 0.152 to 0.3
track width copperThickness1oz (default): min 0.127, default 0.254, max 2.54
track width copperThickness2oz: min 0.203, default 0.254, max 2.54
differential pair differentialPair (default): width min 0.127, default 0.254, max 2.54; gap min 0.152, default 0.152
via viaSize (default): diameter min 0.5, default 0.61, max 10; hole min 0.3, default 0.305, max 6.3

## Placement (name value [footprint] x y rotation side)
BEEP  SUN-09055-3  [BUZ-TH_BD9.0-P5.00-D0.6-FD]  51.18 42.28 180 top
C1  100uF  [CAP-TH_BD5.0-P2.00-D0.8-FD]  9.4 28.95 270 top
C3  100nF  [C0603]  10.79 16.63 0 top
C4  100nF  [C0603]  10.79 11.42 0 top
C5  100nF  [C0603]  26.25 10.19 0 top
C6  100nF  [C0603]  33.19 10.19 0 top
C7  100nF  [C0603]  40 10.19 0 top
C8  10uF  [C0603]  12.7 42.92 90 top
C9  10uF  [C0603]  10.67 42.92 90 top
C10  10uF  [C0603]  23.24 19.17 180 top
C11  10uF  [C0603]  23.24 17.27 180 top
C12  10uF  [C0603]  60.71 23.11 0 top
C13  47pF  [C0603]  46.35 17.65 270 top
C14  47pF  [C0603]  40 17.65 90 top
D1  SS14  [SMA_L4.3-W2.6-LS5.2-RD]  4.7 31.11 270 top
ESD1  0603ESDA-05N  [D0603-BI]  13.84 30.73 0 top
GND  -  [测试点0.9mm]  11.57 9.5 0 top
J1  2P2.54单排针  [HDR-TH_2P-P2.54-V-M]  61.34 36.95 90 top
KEY1  TS-1095-A5B2-D1  [SW-TH_4P-L6.0-W6.0-P4.50-LS6.5]  27.81 4.95 270 top
KEY2  TS-1095-A5B2-D1  [SW-TH_4P-L6.0-W6.0-P4.50-LS6.5]  34.67 4.95 270 top
KEY3  TS-1095-A5B2-D1  [SW-TH_4P-L6.0-W6.0-P4.50-LS6.5]  41.53 4.95 270 top
LED1  KT-0805G  [LED0805-R-RD]  60.27 25.5 0 top
LED2  KT-0805G  [LED0805-R-RD]  60.27 27.87 0 top
LED3  KT-0805G  [LED0805-R-RD]  60.27 30.25 0 top
LED4  KT-0805G  [LED0805-R-RD]  60.27 32.63 0 top
PLED  NCD0805B2  [LED0805-R-RD]  13.46 45.84 0 top
PowerKey  XKB8080-Z  [SW-TH_6P-L8.0-W8.0-P2.50]  11.43 35.94 90 top
Q1  AO3401A  [SOT-23_L2.9-W1.3-P1.90-LS2.4-BR]  20.96 29.97 180 top
Q2  AO3401A  [SOT-23_L2.9-W1.3-P1.90-LS2.4-BR]  29.84 30.09 180 top
Q3  AO3401A  [SOT-23_L2.9-W1.3-P1.90-LS2.4-BR]  38.74 30.09 180 top
Q4  AO3401A  [SOT-23_L2.9-W1.3-P1.90-LS2.4-BR]  47.62 30.09 180 top
Q5  2N3906S-RTK/P  [SOT-23-3_L2.9-W1.6-P1.90-LS2.8-TR-CW]  57.78 41.02 270 top
R1  4.7kΩ  [R0603]  56.19 25.5 0 top
R2  4.7kΩ  [R0603]  56.19 27.87 0 top
R3  4.7kΩ  [R0603]  56.19 30.25 0 top
R4  4.7kΩ  [R0603]  56.19 32.63 0 top
R5  10kΩ  [R0402]  30.1 10.66 90 top
R6  10kΩ  [R0402]  36.96 10.66 90 top
R7  10kΩ  [R0402]  43.81 10.66 90 top
R8  5.1kΩ  [R0603]  10.67 20.31 180 top
R9  5.1kΩ  [R0603]  10.67 22.85 180 top
R10  10kΩ  [R0402]  23.5 20.82 180 top
R11  10kΩ  [R0603]  18.29 29.97 270 top
R12  10kΩ  [R0603]  27.18 30.09 270 top
R13  10kΩ  [R0603]  36.07 30.09 270 top
R14  10kΩ  [R0603]  44.96 30.09 270 top
R15  1kΩ  [R0603]  16.76 29.97 90 top
R16  1kΩ  [R0603]  25.65 30.09 90 top
R17  1kΩ  [R0603]  34.54 30.09 90 top
R18  1kΩ  [R0603]  43.43 30.09 90 top
R19  1kΩ  [R0603]  57.78 36.44 180 top
R20  10kΩ  [R0603]  57.78 38.22 0 top
R21  47Ω  [R0603]  23.5 30.73 270 top
R22  47Ω  [R0603]  32.38 30.86 270 top
R23  47Ω  [R0603]  41.28 30.86 270 top
R24  47Ω  [R0603]  50.16 30.86 270 top
R25  10kΩ  [R0402]  55.25 23.11 180 top
R26  100Ω  [R0603]  57.28 22.35 270 top
R27  10Ω  [R1206]  4.76 37.44 90 top
R28  4.7kΩ  [R0603]  14.49 42.93 270 top
R29  10Ω  [R0603]  49.4 36.44 0 top
R32  1kΩ  [R0603]  10.82 13.18 0 top
R33  1kΩ  [R0603]  10.79 14.85 0 top
R34  1MΩ  [R0603]  43.18 14.98 0 top
RST  轻触开关,3*6*2.5塑头白色,260G,行程0.25mm,贴片 (SMT业务专用)  [SW-SMD_L6.1-W3.6-LS8.0]  61.34 16.89 90 top
RXD  -  [测试点0.9mm]  5.43 9.39 0 top
T1  -  [M3定位孔]  3.49 3.55 0 top
T2  -  [M3定位孔]  60.51 3.55 0 top
T3  -  [M3定位孔]  60.72 45.04 0 top
T4  -  [M3定位孔]  3.53 45.04 0 top
TXD  -  [测试点0.9mm]  3.4 9.39 0 top
U1  STC89C52RC-40I-LQFP44  [LQFP-44_L10.0-W10.0-P0.80-LS12.0-BL]  31.5 20.06 0 top
U2  CH340N  [SOP-8_L5.0-W4.0-P1.27-LS6.0-BL]  4.57 13.33 270 top
U3  SR410361N  [LED-SEG-TH_12P-L30.0-W14.0-P2.54-S10.26-BL]  31.11 39.87 0 top
USB  TYPE-C-31-M-12  [USB-C_SMD-TYPE-C-31-M-12]  5.08 21.84 270 top
USB_IN  -  [测试点0.9mm]  7.38 9.47 0 top
VCC  -  [测试点0.9mm]  9.79 9.47 0 top
X2  12MHz  [OSC-SMD_4P-L3.2-W2.5-BL]  43.18 17.65 0 top

## Footprints (pads in the part's own frame, mm; a bottom-side part is the same pattern mirrored in y, then rotated)
BUZ-TH_BD9.0-P5.00-D0.6-FD
  round 1.8 hole 1: 1(-2.5,0) 2(2.5,0)
C0603
  rect 0.8x0.9 smd: 1(-0.7,0) 2(0.7,0)
CAP-TH_BD5.0-P2.00-D0.8-FD
  round 1.3 hole 0.8: 1(-1,0) 2(1,0)
D0603-BI
  rect 0.873x0.907 smd: 1(-0.622,0) 2(0.622,0)
HDR-TH_2P-P2.54-V-M
  rect 2x2 hole 1.2: 1(-1.27,0)
  round 2 hole 1.2: 2(1.27,0)
LED0805-R-RD
  rect 1x1.399 smd: 1(1.05,0) 2(-1.05,0)
LED-SEG-TH_12P-L30.0-W14.0-P2.54-S10.26-BL
  round 1.6 hole 1: 1(-6.35,-5.13) 2(-3.81,-5.13) 3(-1.27,-5.13) 4(1.27,-5.13) 5(3.81,-5.13) 6(6.35,-5.13) 7(6.35,5.13) 8(3.81,5.13) 9(1.27,5.13) 10(-1.27,5.13) 11(-3.81,5.13) 12(-6.35,5.13)
LQFP-44_L10.0-W10.0-P0.80-LS12.0-BL
  oval 0.42x1.67 smd: 1(-4,-5.735) 2(-3.2,-5.735) 3(-2.4,-5.735) 4(-1.6,-5.735) 5(-0.8,-5.735) 6(0,-5.735) 7(0.8,-5.735) 8(1.6,-5.735) 9(2.4,-5.735) 10(3.2,-5.735) 11(4,-5.735) 23(4,5.735) 24(3.2,5.735) 25(2.4,5.735) 26(1.6,5.735) 27(0.8,5.735) 28(0,5.735) 29(-0.8,5.735) 30(-1.6,5.735) 31(-2.4,5.735) 32(-3.2,5.735) 33(-4,5.735)
  oval 1.67x0.42 smd: 12(5.735,-4) 13(5.735,-3.2) 14(5.735,-2.4) 15(5.735,-1.6) 16(5.735,-0.8) 17(5.735,0) 18(5.735,0.8) 19(5.735,1.6) 20(5.735,2.4) 21(5.735,3.2) 22(5.735,4) 34(-5.735,4) 35(-5.735,3.2) 36(-5.735,2.4) 37(-5.735,1.6) 38(-5.735,0.8) 39(-5.735,0) 40(-5.735,-0.8) 41(-5.735,-1.6) 42(-5.735,-2.4) 43(-5.735,-3.2) 44(-5.735,-4)
M3定位孔
  round 6.2 hole 3.2: 1(0,0)
OSC-SMD_4P-L3.2-W2.5-BL
  rect 1.4x1.2 smd: 1(-1.1,-0.875) 2(1.1,-0.875) 3(1.1,0.875) 4(-1.1,0.875)
R0402
  rect 0.566x0.54 smd: 1(-0.433,0) 2(0.433,0)
R0603
  rect 0.806x0.864 smd: 1(-0.753,0) 2(0.753,0)
R1206
  rect 1.208x1.701 smd: 1(-1.479,0) 2(1.479,0)
SMA_L4.3-W2.6-LS5.2-RD
  rect 2x2 smd: 1(-2.2,0) 2(2.2,0)
SOP-8_L5.0-W4.0-P1.27-LS6.0-BL
  oval 0.574x2.035 smd: 1(-1.905,-2.768) 2(-0.635,-2.768) 3(0.635,-2.768) 4(1.905,-2.768) 5(1.905,2.768) 6(0.635,2.768) 7(-0.635,2.768) 8(-1.905,2.768)
SOT-23-3_L2.9-W1.6-P1.90-LS2.8-TR-CW
  rect 1.25x0.7 smd: 1(1.25,0.95) 2(1.25,-0.95) 3(-1.25,0)
SOT-23_L2.9-W1.3-P1.90-LS2.4-BR
  rect 1x0.8 smd: 1(1.15,-0.95) 2(1.15,0.95) 3(-1.15,0)
SW-SMD_L6.1-W3.6-LS8.0
  rect 2x1.38 smd: 1(-4,0) 2(4,0)
SW-TH_4P-L6.0-W6.0-P4.50-LS6.5
  round 1.8 hole 1.2: 1(-3.25,2.25) 2(3.25,2.25) 3(-3.25,-2.25) 4(3.25,-2.25)
SW-TH_6P-L8.0-W8.0-P2.50
  rect 1.524x1.524 hole 1: 1(-2.5,-3)
  round 1.524 hole 1: 2(0,-3) 3(2.5,-3) 4(-2.5,3) 5(0,3) 6(2.5,3)
USB-C_SMD-TYPE-C-31-M-12
  oval 1.2x2 hole 0.8x1.6: 0(-4.325,1.706) 1(4.325,1.706)
  oval 1.2x1.8 hole 0.8x1.4: 2(4.325,-2.474) 3(-4.325,-2.474)
  rect 0.3x1.3 smd: A1(-3.35,2.474) A4(-2.55,2.474) A5(-1.25,2.474) A6(-0.25,2.474) A7(0.25,2.474) A8(1.25,2.474) A9(2.55,2.474) A12(3.35,2.474) B1(3.05,2.474) B4(2.25,2.474) B5(1.75,2.474) B6(0.75,2.474) B7(-0.75,2.474) B8(-1.75,2.474) B9(-2.25,2.474) B12(-3.05,2.474)
测试点0.9mm
  round 1.5 hole 0.9: 1(0,0)

## Nets
As in the schematic.

Pads without a net: KEY1 2 4; KEY2 2 4; KEY3 2 4; U1 1 2 3 6 11 12 16 17 26 27 28 39 41 42 43 44; U2 4; USB A8 B8

## Via types
v1: diameter 0.61, hole 0.305, Top Layer to Bottom Layer, 40 vias

## Routing (per net, layer and track width the routed paths; a pad name or vN(x,y) marks a point on that pad's centre or on a via; arc(x,y) is an arc through that point)
GND: length 227
  Top Layer w0.254: v1(22.61,16) 22.54,16.06 22.54,19.17 ; KEY3.3 38.1,7.02 33.6,7.02 KEY2.3 ; KEY3.3 40.46,7.02 52.74,7.02 ; KEY3.3 39.31,8.22 39.31,10.15 ; T4.1 5.2,43.38 6.13,42.44 ; USB.B1 USB.A12 7.55,18.28 USB.1 ; T2.1 57.05,7.02 52.74,7.02 ; 9.4,24.89 USB.B12 ; 9.4,24.89 9.4,26.16 ; 9.4,24.89 10.67,24.89 11.42,24.13 11.42,17.51 ; 6.13,42.44 7.3,43.62 C9.2 C8.2 12.7,45.55 PLED.2 ; 6.13,42.44 4.76,41.08 R27.2 ; T3.1 53.81,45.04 50.16,41.39 R29.2 v1(51.31,36.44) ; 11.42,17.51 USB.1 ; 11.42,17.51 11.42,16.7 11.5,16.63 11.5,16.19 10.79,15.49 10.79,12.12 11.57,11.35 GND.1 ; 32.49,10.22 32.49,8.27 KEY2.3 ; USB.1 USB.2 ; USB.1 6.79,16.81 2.67,12.69 U2.3 ; KEY2.3 32.42,7.9 31.53,7.02 26.74,7.02 KEY1.3 25.55,8.21 25.55,10.22 ; 52.74,7.02 54.74,9.01 v1(54.74,22.35) 54.74,23.03 R25.2 ; 9.4,26.16 USB.0 USB.3 ; 9.4,26.16 C1.2 7.16,30.19 3.97,30.19 3.42,30.74 3.42,37.58 R27.2 ; ESD1.1 13.22,36.05 12.29,36.98 6.71,36.98 R27.2
  Bottom Layer w0.254: v1(54.74,22.35) 54.74,33.01 v1(51.31,36.44) ; v1(22.61,16) 22.61,11.15 KEY1.3 20.92,3.55 T1.1
  vias: v1(25.44,14.06) v1(27.56,33.27) v1(27.81,28.19) v1(28.57,19.17) v1(31.88,27.43) v1(32.51,23.62) v1(42.29,33.65) v1(46.99,33.27)
VCC: length 133.8
  Top Layer w0.254: U1.38 23.97,20.86 R10.1
  Top Layer w0.762: v1(45.47,11.17) 43.89,11.17 R7.2 43.74,11.17 37.03,11.17 R6.2 36.96,11.17 30.24,11.17 30.21,11.2 30.17,11.17 ; C11.1 C10.1 23.94,20.81 R10.1 ; R28.2 14.44,42.22 ; 14.44,42.22 14.44,38.45 PowerKey.3 ; 14.44,42.22 C8.1 C9.1 9.59,42.22 8.43,41.06 PowerKey.6 ; 30.17,11.17 R5.2 ; 30.17,11.17 20.7,11.17 17.75,8.22 10.7,8.22 9.79,9.12 VCC.1 ; v1(23.97,21.84) 23.97,20.86 ; v1(59.44,20.69) 61.15,20.69 RST.2 61.41,20.95 C12.2 61.32,23.19 LED1.1 LED2.1 LED3.1 LED4.1 61.34,32.65 J1.1
  Bottom Layer w0.762: v1(59.44,20.69) 54.96,20.69 45.47,11.2 v1(45.47,11.17) ; VCC.1 9.79,18.5 13.13,21.84 ; 13.13,21.84 v1(23.97,21.84) ; 13.13,21.84 13.13,37.14 PowerKey.3
BEEP: length 42.3
  Top Layer w0.254: R19.1 55.44,33.34 54.83,33.34 50.31,28.82 v1(47.88,28.82) ; U1.40 26.76,19.26 v1(29.21,21.71)
  Bottom Layer w0.254: v1(29.21,21.71) 33.65,21.71 35.28,23.34 35.28,27.4 36.7,28.82 v1(47.88,28.82)
D+: length 15.2
  Top Layer w0.254: U2.1 0.86,16.17 0.86,20.55 1.4,21.09 USB.B6 8.25,21.09 8.51,21.34 8.51,21.83 8.25,22.09 USB.A6
D-: length 21.8
  Top Layer w0.254: 1.4,21.59 0.51,20.69 0.51,14.34 0.89,13.96 U2.2 ; 1.4,21.59 USB.A7 ; 1.4,21.59 2.4,22.59 USB.B7
KEY1: length 11.1
  Top Layer w0.254: v1(31.12,10.28) 30.15,10.28 R5.1 ; R5.1 30.09,10.22 26.95,10.22 ; R5.1 30.1,8.23 KEY1.1 ; U1.8 33.1,12.52 v1(33.02,12.44)
  Bottom Layer w0.254: v1(31.12,10.28) 31.12,10.53 v1(33.02,12.44)
KEY2: length 11.8
  Top Layer w0.254: v1(33.9,8.88) 33.9,10.22 33.89,10.22 36.84,10.22 36.96,10.1 36.96,8.23 KEY2.1 ; U1.9 33.91,14.31 v1(33.91,12.44)
  Bottom Layer w0.254: v1(33.9,8.88) 33.91,8.9 v1(33.91,12.44)
KEY3: length 17.2
  Top Layer w0.254: v1(40.77,8.88) 40.77,10.09 40.71,10.15 43.76,10.15 43.81,10.1 43.81,8.23 KEY3.1 ; v1(34.67,12.44) 34.67,14.3 U1.10
  Bottom Layer w0.254: v1(40.77,8.88) 40.77,11.17 39.5,12.44 v1(34.67,12.44)
LED1: length 18.8
  Top Layer w0.254: U1.22 54,24.06 R1.1
LED2: length 21.2
  Top Layer w0.254: U1.23 35.5,26.47 36.32,27.3 52.99,27.3 53.56,27.87 R2.1
LED3: length 23
  Top Layer w0.254: R3.1 52.99,27.81 36.07,27.81 34.7,26.44 U1.24
LED4: length 24.7
  Top Layer w0.254: R4.1 51.04,28.24 35.74,28.24 33.9,26.4 U1.25
RST: length 35.1
  Top Layer w0.254: U1.4 29.9,15.67 v1(29.97,15.74) ; v1(55.75,22.35) 55.68,22.42 R25.1 57.27,23.11 R26.1 60,23.1 C12.1
  Bottom Layer w0.254: v1(55.75,22.35) 52.76,19.35 33.58,19.35 v1(29.97,15.74)
RXD: length 7.5
  Top Layer w0.254: RXD.1 5.43,11.65 6.48,12.69 U2.6 9.59,12.69 R32.1
SEGA: length 31.9
  Top Layer w0.254: U1.30 29.9,24.43 28.83,23.36 v1(28.83,23.23)
  Bottom Layer w0.254: U3.11 23.33,41.03 23.33,24.29 25.15,22.47 28.07,22.47 v1(28.83,23.23)
SEGB: length 33.5
  Top Layer w0.254: U1.31 29.1,24.77 28.45,24.12 v1(27.43,24.12)
  Bottom Layer w0.254: v1(27.43,24.12) 25.84,25.72 25.84,40.5 29.26,43.92 36.38,43.92 U3.7
SEGC: length 12.5
  Top Layer w0.254: U1.32 28.3,26.51 30.23,28.44 32.09,28.44 33.27,29.63 33.27,33.85 U3.4
SEGD: length 10.7
  Top Layer w0.254: U1.33 27.5,26.47 29.47,28.45 29.47,32.57 U3.2
SEGDP: length 16.1
  Top Layer w0.254: U1.37 27.38,21.66 v1(27.43,21.71)
  Bottom Layer w0.254: U3.3 29.84,23.42 28.13,21.71 v1(27.43,21.71)
SEGE: length 11.1
  Top Layer w0.254: U1.34 24.76,25.06 U3.1
SEGF: length 29
  Top Layer w0.254: U1.35 25.79,23.23 v1(27.43,23.23)
  Bottom Layer w0.254: U3.10 23.68,38.84 23.68,24.45 24.89,23.23 v1(27.43,23.23)
SEGG: length 20.8
  Top Layer w0.254: v1(29.84,22.47) 25.77,22.47 U1.36
  Bottom Layer w0.254: v1(29.84,22.47) 33.91,22.47 34.92,23.48 U3.5
SEL0: length 24.5
  Top Layer w0.254: v1(35.69,20.82) 35.72,20.86 U1.18 ; R15.1 v1(16.76,28.31)
  Bottom Layer w0.254: v1(35.69,20.82) 26.29,20.82 18.8,28.31 v1(16.76,28.31)
SEL1: length 53.3
  Top Layer w0.254: U1.19 38.56,21.66 v1(38.61,21.71) ; R16.1 25.65,29.2 v1(26.67,28.19)
  Bottom Layer w0.254: v1(38.61,21.71) 46.98,21.71 49.17,23.91 49.17,29.41 42.4,36.18 27.21,36.18 26.2,35.16 26.2,28.66 v1(26.67,28.19)
SEL2: length 43.9
  Top Layer w0.254: U1.20 37.24,22.47 v1(38.61,22.47) ; R17.1 33.53,28.32 v1(33.53,28.31)
  Bottom Layer w0.254: v1(33.53,28.31) 33.53,34.88 34.47,35.82 42.26,35.82 48.82,29.26 48.82,24.05 47.24,22.47 v1(38.61,22.47)
SEL3: length 24
  Top Layer w0.254: R18.1 43.32,29.46 v1(42.29,29.46) ; U1.21 37.26,23.23 v1(38.61,23.23)
  Bottom Layer w0.254: v1(42.29,29.46) 48.07,29.46 48.46,29.06 48.46,24.2 47.5,23.23 v1(38.61,23.23)
TXD: length 9.8
  Top Layer w0.254: R33.1 9.15,13.96 U2.7 6.48,13.96 3.4,10.89 TXD.1
USB_IN: length 51
  Top Layer w0.254: 7.38,9.51 USB_IN.1 ; 7.38,9.51 v1(6.35,10.53) ; 7.38,9.51 7.38,11.38 U2.5 ; C4.1 10.06,11.38 7.76,11.38 ; PowerKey.2 PowerKey.1 14.43,30.76 ESD1.2 14.46,30.46 13.95,29.95 C1.1 9.4,31.11 8.43,32.08 PowerKey.4 PowerKey.5 4.79,35.94 R27.1 4.7,35.9 D1.1
  Bottom Layer w0.254: C1.1 8.93,29.95 5.48,26.5 5.48,11.4 v1(6.35,10.53)
$1N3771: length 2.4
  Top Layer w0.254: USB.A5 9.89,23.09 9.91,23.11
$1N4055: length 3.3
  Top Layer w0.254: C3.1 8.7,15.23 U2.8
$1N8289: length 2.2
  Top Layer w0.254: PLED.1 14.51,43.71 R28.1
$1N8781: length 2.3
  Top Layer w0.254: R1.2 LED1.2
$1N8784: length 2.3
  Top Layer w0.254: R2.2 LED2.2
$1N8787: length 2.3
  Top Layer w0.254: R3.2 LED3.2
$1N8790: length 2.3
  Top Layer w0.254: LED4.2 R4.2
$1N10096: length 5.9
  Top Layer w0.254: BEEP.2 48.68,36.47 R29.1
$1N10100: length 4.1
  Top Layer w0.254: Q5.3 53.7,42.26 BEEP.1
$1N10108: length 3.4
  Top Layer w0.254: R19.2 R20.1 56.84,38.42 Q5.2
$1N10210: length 4.4
  Top Layer w0.254: 58.74,39.77 58.74,38.42 R20.2 J1.2
$1N11626: length 21.1
  Top Layer w0.254: U1.5 30.7,13.67 29.72,12.69 25.28,12.69 23.12,14.85 R33.2
$1N11629: length 22.3
  Top Layer w0.254: R32.2 24.29,13.18 25.13,12.34 31.01,12.34 32.26,13.58 32.26,14.29 U1.7
$1N11974: length 10.4
  Top Layer w0.254: R26.2 57.28,19.68 61.34,15.61 RST.1
$1N12457: length 6.9
  Top Layer w0.254: R34.1 42.43,16.43 X2.1 41.91,16.95 C14.1 39.92,16.86 U1.13
$1N12469: length 17.6
  Top Layer w0.254: U1.14 v1(38.86,17.66) ; R34.2 v1(45.21,14.98) 46.23,14.98 47.08,15.84 47.08,17.68 46.42,18.35 C13.1 46.18,18.52 X2.3
  Bottom Layer w0.254: v1(45.21,14.98) 42.53,17.66 v1(38.86,17.66)
$1N12478: length 10
  Top Layer w0.254: U1.15 39.89,18.46 C14.2 41.91,18.35 X2.4 42.53,18.52 X2.2 46.18,16.77 C13.2
$1N14587: length 22.8
  Top Layer w0.254: R10.2 22.61,20.82 21.86,20.08 21.86,15.91 22.36,15.41 26.85,15.41 30.7,19.26 U1.29
$1N21020: length 14
  Top Layer w0.254: R21.1 23.5,43.74 U3.12
$1N21183: length 3.2
  Top Layer w0.254: Q2.1 27.37,31.04 R12.1 27.14,30.81 25.61,30.81
$1N21186: length 1.4
  Top Layer w0.254: R22.2 32.38,30.09 Q2.3
$1N21187: length 1.6
  Top Layer w0.254: Q2.2 28.5,29.34 R12.2
$1N21192: length 14.4
  Top Layer w0.254: R22.1 31.12,32.88 31.12,43.74 U3.9
$1N21353: length 3.1
  Top Layer w0.254: R17.2 R13.1 37.39,30.85 Q3.1
$1N21356: length 1.4
  Top Layer w0.254: R23.2 41.27,30.09 39.88,30.09
$1N21357: length 1.6
  Top Layer w0.254: R13.2 37.39,29.34 Q3.2
$1N21513: length 3.1
  Top Layer w0.254: Q1.1 19.61,30.72 R11.1 R15.2
$1N21516: length 1.4
  Top Layer w0.254: 22.1,29.97 23.49,29.97 R21.2
$1N21517: length 1.6
  Top Layer w0.254: Q1.2 18.48,29.02 R11.2
$1N21530: length 17.7
  Top Layer w0.254: U3.8 36.19,43.73 36.19,33.9 37.08,33.01 39.87,33.01 R23.1
$1N21889: length 3.1
  Top Layer w0.254: R18.2 R14.1 46.28,30.85 Q4.1
$1N21892: length 1.4
  Top Layer w0.254: R24.2 50.16,30.09 Q4.3
$1N21893: length 1.6
  Top Layer w0.254: R14.2 46.28,29.34 Q4.2
$1N21896: length 14
  Top Layer w0.254: R24.1 47.03,34.74 U3.6
$1N26570: length 2.4
  Top Layer w0.254: 9.91,20.06 7.58,20.06 USB.B5
$1N26577: length 24
  Top Layer w0.254: USB.A9 7.69,19.42 10.26,19.42 10.67,19.84 10.67,23.49 9.77,24.39 USB.A4 ; USB.B9 6.75,24.09 6.54,23.87 2.29,23.87 1.43,24.73 1.43,28.09 2.25,28.91 D1.2

## Copper pours and planes (outline as drawn; the poured copper is in the pictures)
GND on Top Layer: -4.7,51.56 69.22,51.56 69.22,-2.67 -4.7,-2.67
GND on Bottom Layer: -4.7,51.43 69.22,51.43 69.22,-2.67 -4.7,-2.67

Small or netless copper shapes (teardrops, artwork), in the pictures only: 299 on Top Layer, 42 on Bottom Layer
